# Altium schematic sheet Блок4.SchDoc
size A4
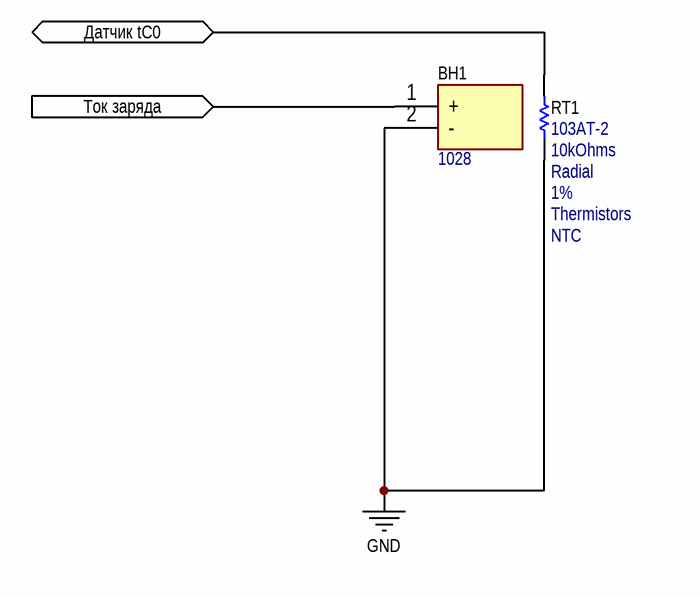
[diagram p0: Блок4.SchDoc]

## Parts
BH1  1028  [1028]
RT1  103AT-2  Resistance: 10kOhms  Termination Style: Radial  Tolerance: 1%  Product Category: Thermistors  Type: NTC  [SEMI-103AT-2_V]

## Ports
Датчик tC0 (bidir), Ток заряда (in)

## Nets
GND: BH1.2(-) RT1.1
Датчик tC0: RT1.2 ; port Датчик tC0
Ток заряда: BH1.1(+) ; port Ток заряда

## Library data of the parts
BH1 = 1028: Undefined or Miscellaneous; Manufacturer_Name: Keystone Electronics; Datasheet Link: http://www.keyelco.com/product-pdf.cfm?p=929; Height: 15.49mm; Manufacturer_Part_Number: 1028; Mouser Part Number: 534-1028; Mouser Price/Stock: https://www.mouser.co.uk/ProductDetail/Keystone-Electronics/1028?qs=TMDrOSIpnUdoTBwO9TubhA%3D%3D; Arrow Part Number: 1028; Arrow Price/Stock: https://www.arrow.com/en/products/1028/keystone-electronics
RT1 = CMP-2000-05824-1: Precision NTC Thermistor, 10 kOhm, +/- 1%, 10 mW, -50 to 110 degC, 2-Pin THD, RoHS, Bulk; Brand: Semitec; Packaging: Bulk; Mounting Technology: ThroughHole; Operating Temperature Range: -50Cto+110C; Lead Spacing: 2.54mm; RoHS: True; Manufacturer URL: http://www.semitec.co.jp/english/; Datasheet Version: Rev. A, 02/2007; Length: 17mm; Manufacturer: Semitec; Datasheet URL: https://www.rapidonline.com/pdf/61-0500e.pdf; Series: AT; Package Description: 2-Pin Through Hole Device, Body Width 3.8 mm (Max), Pitch 2.54 mm; Width: 3.7mm; Package Reference: 103AT-2; Height: 2.4mm